# Altium schematic sheet FE_Channel.SchDoc: ThunderScope 1000E
size A4; DrawnBy: Aleksa Bjelogrlic; Revision: 1
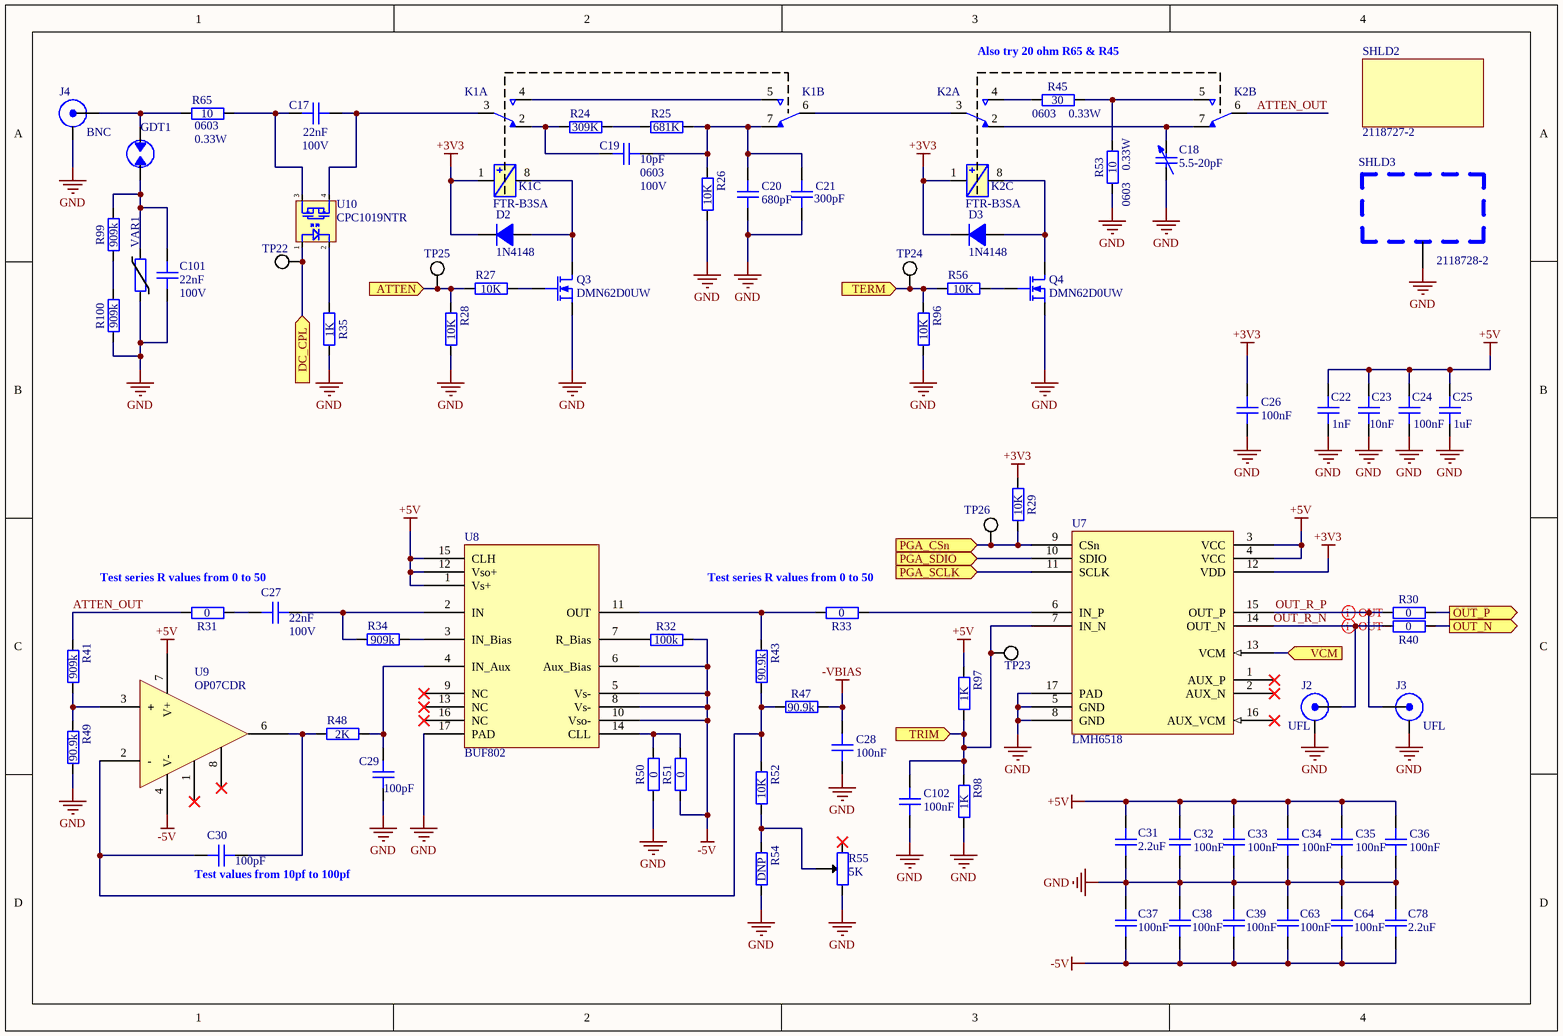
[diagram p0: FE_Channel.SchDoc]

## Parts
C17  22nF  Voltage Rating: 100V  [GEN_C_0603]
C18  5.5-20pF  [EW_TRIMCAP]
C19  10pF  Package: 0603  Voltage Rating: 100V  [GEN_C_0603]
C20  680pF  [GEN_C_0402]
C21  300pF  [GEN_C_0402]
C22  1nF  [GEN_C_0402]
C23  10nF  [GEN_C_0402]
C24  100nF  [GEN_C_0402]
C25  1uF  [GEN_C_0402]
C26  100nF  [GEN_C_0402]
C27  22nF  Voltage Rating: 100V  [GEN_C_0603]
C28  100nF  [GEN_C_0402]
C29  100pF  [GEN_C_0402]
C30  100pF  [GEN_C_0402]
C31  2.2uF  [GEN_C_0402]
C32  100nF  [GEN_C_0402]
C33  100nF  [GEN_C_0402]
C34  100nF  [GEN_C_0402]
C35  100nF  [GEN_C_0402]
C36  100nF  [GEN_C_0402]
C37  100nF  [GEN_C_0402]
C38  100nF  [GEN_C_0402]
C39  100nF  [GEN_C_0402]
C63  100nF  [GEN_C_0402]
C64  100nF  [GEN_C_0402]
C78  2.2uF  [GEN_C_0402]
C101  22nF  Voltage Rating: 100V  [GEN_C_0603]
C102  100nF  [GEN_C_0402]
D2  1N4148  [GEN_SOD_323]
D3  1N4148  [GEN_SOD_323]
GDT1  4532-075-LF  [BOU_2051]  (value not drawn)
J2  UFL  [TE_2334884-1]
J3  UFL  [TE_2334884-1]
J4  BNC  [MOL_0731000105]
K1  FTR-B3SA  [FUJ_FTR-B3SA]  (value not drawn)  (parts A,B,C of 3)
K2  FTR-B3SA  [FUJ_FTR-B3SA]  (value not drawn)  (parts A,B,C of 3)
Q3  DMN62D0UW  [GEN_SOT_323]
Q4  DMN62D0UW  [GEN_SOT_323]
R24  309K  [GEN_R_0402]
R25  681K  [GEN_R_0402]
R26  10K  [GEN_R_0402]
R27  10K  [GEN_R_0402]
R28  10K  [GEN_R_0402]
R29  10K  [GEN_R_0402]
R30  0  [GEN_R_0402]
R31  0  [GEN_R_0402]
R32  100k  [GEN_R_0402]
R33  0  [GEN_R_0402]
R34  909k  [GEN_R_0402]
R35  1K  [GEN_R_0402]
R40  0  [GEN_R_0402]
R41  909k  [GEN_R_0402]
R43  90.9k  [GEN_R_0402]
R45  30  Power Rating: 0.33W  Package: 0603  [GEN_R_0603]
R47  90.9k  [GEN_R_0402]
R48  2K  [GEN_R_0402]
R49  90.9k  [GEN_R_0402]
R50  0  [GEN_R_0402]
R51  0  [GEN_R_0402]
R52  10K  [GEN_R_0402]
R53  10  Power Rating: 0.33W  Package: 0603  [GEN_R_0603]
R54  DNP  [GEN_R_0402]  (no BOM)
R55  5K  [BOU_3mm_POT]
R56  10K  [GEN_R_0402]
R65  10  Package: 0603  Power Rating: 0.33W  [GEN_R_0603]
R96  10K  [GEN_R_0402]
R97  1K  [GEN_R_0402]
R98  1K  [GEN_R_0402]
R99  909k  [GEN_R_0402]
R100  909k  [GEN_R_0402]
SHLD2  2118727-2  (mechanical)
SHLD3  2118728-2  [TE_2118728-2]
TP22  PCB  [GEN_TP_PCB]  (value not drawn)  (no BOM)
TP23  PCB  [GEN_TP_PCB]  (value not drawn)  (no BOM)
TP24  PCB  [GEN_TP_PCB]  (value not drawn)  (no BOM)
TP25  PCB  [GEN_TP_PCB]  (value not drawn)  (no BOM)
TP26  PCB  [GEN_TP_PCB]  (value not drawn)  (no BOM)
U7  LMH6518  [TI_WQFN_RGH0016A]
U8  BUF802  [TI_VQFN_RGT0016C]
U9  OP07CDR  [TI_SOIC8_D0008A]
U10  CPC1019NTR  [IXY_CPC1017]
VAR1  ZV40K1210251NIR1HT  [GEN_VAR_1210]  (value not drawn)

## Ports
ATTEN (in), DC_CPL (in), OUT_N (out), OUT_P (out), PGA_CSn (in), PGA_SCLK (in), PGA_SDIO (in), TERM (in), TRIM (in), VCM (in)

## Nets
+3V3: C26.2 D2.1(K) D3.1(K) K1.1 K2.1 R29.2 U7.12(VDD)
+5V: C22.2 C23.2 C24.2 C25.2 C31.2 C32.1 C33.1 C34.1 C35.2 C36.2 R97.2 U7.3(VCC) U7.4(VCC) U8.1(Vs+) U8.12(Vso+) U8.15(CLH) U9.7(V+)
-5V: C37.2 C38.2 C39.1 C63.1 C64.1 C78.2 R32.2 R51.1 U8.5(Vs-) U8.6(Aux_Bias) U8.8(Vs-) U8.10(Vso-) U9.4(V-)
-VBIAS: C28.1 R47.1
GND: C18.2 C20.1 C21.1 C22.1 C23.1 C24.1 C25.1 C26.1 C28.2 C29.1 C31.1 C32.2 C33.2 C34.2 C35.1 C36.1 C37.1 C38.1 C39.2 C63.2 C64.2 C78.1 C101.2 C102.2 J2.2(SHIELD) J3.2(SHIELD) J4.2(SHIELD) Q3.3(S) Q4.3(S) R26.1 R28.1 R35.1 R49.1 R50.1 R53.1 R54.1 R55.3 R96.1 R98.1 R100.1 SHLD3.1 U7.5(GND) U7.8(GND) U7.17(PAD) U8.17(PAD) VAR1.1
ATTEN: R27.2 R28.2 TP25.1 ; port ATTEN
ATTEN_OUT: K2.6 R31.1 R41.2
DC_CPL: TP22.1 U10.1 ; port DC_CPL
OUT_N: R40.2 ; port OUT_N
OUT_P: R30.2 ; port OUT_P
OUT_R_N: J2.1(Signal) R40.1 U7.14(OUT_N)
OUT_R_P: J3.1(Signal) R30.1 U7.15(OUT_P)
PGA_CSn: R29.1 TP26.1 U7.9(CSn) ; port PGA_CSn
PGA_SCLK: U7.11(SCLK) ; port PGA_SCLK
PGA_SDIO: U7.10(SDIO) ; port PGA_SDIO
TERM: R56.2 R96.2 TP24.1 ; port TERM
TRIM: C102.1 R97.1 R98.2 TP23.1 U7.7(IN_N) ; port TRIM
VCM: U7.13(VCM) ; port VCM
NetC17_1: C17.1 K1.3 U10.4
NetC17_2: C17.2 R65.2 U10.3
NetC18_1: C18.1 K2.2 K2.7
NetC19_1: C19.1 C20.2 C21.2 K1.7 R25.2 R26.2
NetC19_2: C19.2 K1.2 R24.1
NetC27_1: C27.1 R34.2 U8.2(IN)
NetC27_2: C27.2 R31.2
NetC29_2: C29.2 R48.1 U8.4(IN_Aux)
NetC30_1: C30.1 R48.2 U9.6(OUT)
NetC30_2: C30.2 R43.1 R47.2 R52.2 U9.2(-)
NetC101_1: C101.1 GDT1.2 R99.2 VAR1.2
NetD2_2: D2.2(A) K1.8 Q3.1(D)
NetD3_2: D3.2(A) K2.8 Q4.1(D)
NetGDT1_1: GDT1.1 J4.1(Signal) R65.1
NetK1_4: K1.4 K1.5
NetK1_6: K1.6 K2.3
NetK2_4: K2.4 R45.1
NetK2_5: K2.5 R45.2 R53.2
NetQ3_2: Q3.2(G) R27.1
NetQ4_2: Q4.2(G) R56.1
NetR24_2: R24.2 R25.1
NetR32_1: R32.1 U8.7(R_Bias)
NetR33_1: R33.1 R43.2 U8.11(OUT)
NetR33_2: R33.2 U7.6(IN_P)
NetR34_1: R34.1 U8.3(IN_Bias)
NetR35_2: R35.2 U10.2
NetR41_1: R41.1 R49.2 U9.3(+)
NetR50_2: R50.2 R51.2 U8.14(CLL)
NetR52_1: R52.1 R54.2 R55.2
NetR99_1: R99.1 R100.2

Not connected (* = marked no-connect by the designer): R55 1*; U7 1(AUX_P)* 2(AUX_N)* 16(AUX_VCM)*; U8 9(NC)* 13(NC)* 16(NC)*; U9 1(N1)* 8(N2)*

## Layout directives
differential pair; differential pair class 100Z_Diff_PGA: OUT_R_N, OUT_R_P

## Notes on the sheet
- Also try 20 ohm R65 & R45
- Test series R values from 0 to 50
- (near R33) Test series R values from 0 to 50
- (near C30) Test values from 10pf to 100pf

## Library data of the parts
C17 C27 C101 = CAP 22nF 100V X7R 0603: Package: 0603; Supplier 1: Digi-Key; Supplier Part Number 1: 490-4782-1-ND; Value: 22nF
C18 = CAP TRIMMER 5.5-20PF 500V: Value: 5.5-20pF; Supplier 1: Digikey; Supplier Part Number 1: 2447-SGC3S200NMCT-ND
C19 = CAP 10pF 100V C0G 0603: Supplier 1: Digi-Key; Supplier Part Number 1: 478-5769-1-ND; Value: 10pF
C20 = CAP 680pF 50V C0G 0402: Voltage Rating: 50V; Temperature Coefficient: C0G; Package: 0402; Supplier 1: Digi-Key; Supplier Part Number 1: 490-16439-1-ND; Value: 680pF
C21 = CAP 300pF 50V C0G 0402: Voltage Rating: 50V; Temperature Coefficient: C0G; Package: 0402; Supplier 1: Digi-Key; Supplier Part Number 1: 490-GCM1555C1H301FA16DCT-ND; Value: 300pF
C22 = CAP 1nF 50V C0G 0402: Voltage Rating: 50V; Package: 0402; Supplier 1: Digi-Key; Supplier Part Number 1: 490-6189-1-ND; Value: 1nF
C23 = CAP 10nF 50V X7R 0402: Voltage Rating: 50V; Package: 0402; Supplier 1: Digi-Key; Supplier Part Number 1: 490-6351-1-ND; Value: 10nF
C24 C26 C28 C32-C39 C63 C64 C102 = CAP 100nF 16V X7R 0402: Voltage Rating: 16V; Package: 0402; Supplier 1: Digi-Key; Supplier Part Number 1: 490-4759-1-ND; Value: 100nF
C25 = CAP 1uF 25V X5R 0402: Voltage Rating: 25V; Package: 0402; Supplier 1: Digi-Key; Supplier Part Number 1: 490-10017-1-ND; Value: 1uF
C29 C30 = CAP 100pF 50V C0G 0402: Temperature Coefficient: C0G; Voltage Rating: 50V; Package: 0402; Value: 100pF; Supplier 1: Digi-Key; Supplier Part Number 1: 490-14349-1-ND
C31 C78 = CAP 2.2uF 10V X5R 0402: Voltage Rating: 10V; Package: 0402; Supplier 1: Digi-Key; Supplier Part Number 1: 587-3153-1-ND; Value: 2.2uF
D2 D3 = DIODE 1N4148: Max Reverse Voltage: 75V; Max Current: 150mA; Supplier 1: Digi-Key; Supplier Part Number 1: 1N4148WS-FDICT-ND
GDT1 = GDT 75V 1812: Supplier 1: Digi-Key; Supplier Part Number 1: YAG6774CT-ND
J2 J3 = UFL Jack SMD: Supplier 1: Digi-Key; Supplier Part Number 1: A145155CT-ND
J4 = BNC JACK R/A: Supplier 1: Digi-Key; Supplier Part Number 1: WM5524-ND
K1 K2 = RELAY DPDT-NO FTR-B3SA: Supplier 1: Mouser; Supplier Part Number 1: 817-FTR-B3SA003Z
Q3 Q4 = NMOS DMN62D0UW: Vdss: 60V; Id: 340mA; Max Power: 320mW; Supplier 1: Digi-Key; Supplier Part Number 1: DMN62D0UW-7DICT-ND
R24 = RES 309K OHM 1% 1/16W 0402: Tolerance: 1%; Power Rating: 0.0625W; Package: 0402; Supplier 1: Digi-Key; Supplier Part Number 1: YAG3108CT-ND; Value: 309K
R25 = RES 681K OHM 1% 1/16W 0402: Tolerance: 1%; Power Rating: 0.0625W; Package: 0402; Supplier 1: Digi-Key; Supplier Part Number 1: YAG3212CT-ND; Value: 681K
R26-R29 R52 R56 R96 = RES 10K OHM 1% 1/10W 0402: Tolerance: 1%; Power Rating: 0.1W; Package: 0402; Supplier 1: Digi-Key; Supplier Part Number 1: P10.0KLCT-ND; Value: 10K
R30 R31 R33 R40 R50 R51 = RES 0 OHM 1/16W 0402: Power Rating: 0.0625W; Package: 0402; Supplier 1: Digi-Key; Supplier Part Number 1: 311-0.0JRCT-ND; Value: 0
R32 = RES 100K OHM 1% 1/10W 0402: Tolerance: 1%; Power Rating: 0.1W; Package: 0402; Value: 100k; Supplier 1: Digi-Key; Supplier Part Number 1: 311-100KLRCT-ND
R34 R41 R99 R100 = RES 909K OHM 1% 1/16W 0402: Tolerance: 1%; Power Rating: 0.0625W; Package: 0402; Supplier 1: Digi-Key; Supplier Part Number 1: YAG2377CT-ND; Value: 909k
R35 R97 R98 = RES 1K OHM 1% 1/10W 0402: Tolerance: 1%; Power Rating: 0.1W; Package: 0402; Supplier 1: Digi-Key; Supplier Part Number 1: 311-1.00KLRCT-ND; Value: 1K
R43 R47 R49 = RES 90.9K OHM 1% 1/16W 0402: Tolerance: 1%; Power Rating: 0.0625W; Package: 0402; Supplier 1: Digi-Key; Supplier Part Number 1: 311-90.9KLRCT-ND; Value: 90.9k
R45 = RES 30 OHM 1% 1/3W 0603: Tolerance: 1%; Value: 30; Supplier 1: Digi-Key; Supplier Part Number 1: 2019-SG73P1JTTD30R0FCT-ND
R48 = RES 2K OHM 1% 1/16W 0402: Tolerance: 1%; Power Rating: 0.0625W; Package: 0402; Supplier 1: Digi-Key; Supplier Part Number 1: 311-2KLRCT-ND; Value: 2K
R53 R65 = RES 10 OHM 1% 1/3W 0603: Tolerance: 1%; Value: 10; Supplier 1: Digi-Key; Supplier Part Number 1: 2019-SG73P1JTTD10R0FCT-ND
R54 = RES DNP 0402: Tolerance: 1%; Power Rating: 0.0625W; Package: 0402; Value: DNP
R55 = TRIMMER 5K OHM 0.1W J LEAD TOP: Tolerance: 1%; Power Rating: 0.1W; Supplier 1: Digi-Key; Supplier Part Number 1: TC33X-502ECT-ND; Value: 5K
SHLD2 = SHIELD 2118727-2: Supplier 1: Digi-Key; Supplier Part Number 1: A126132-ND
SHLD3 = SHIELD 2118728-2: Supplier 1: Digi-Key; Supplier Part Number 1: A126158CT-ND
TP22-TP26 = TP PCB 1mm
U7 = IC PGA LMH6518: Supplier 1: Digi-Key; Supplier Part Number 1: LMH6518SQE/NOPBCT-ND
U8 = IC BUFFER AMP BUF802: Supplier 1: Mouser; Supplier Part Number 1: 595-BUF802IRGTR
U9 = IC OPAMP OP07CDR: Supplier 1: Digi-Key; Supplier Part Number 1: 296-14626-1-ND
U10 = SSR CPC1019NTR: Supplier 1: Mouser; Supplier Part Number 1: 849-CPC1019NTR
VAR1 = VARISTOR 68V 250A 1210: Supplier 1: Digi-Key; Supplier Part Number 1: 118-ZV40K1210251NIR1HTCT-ND